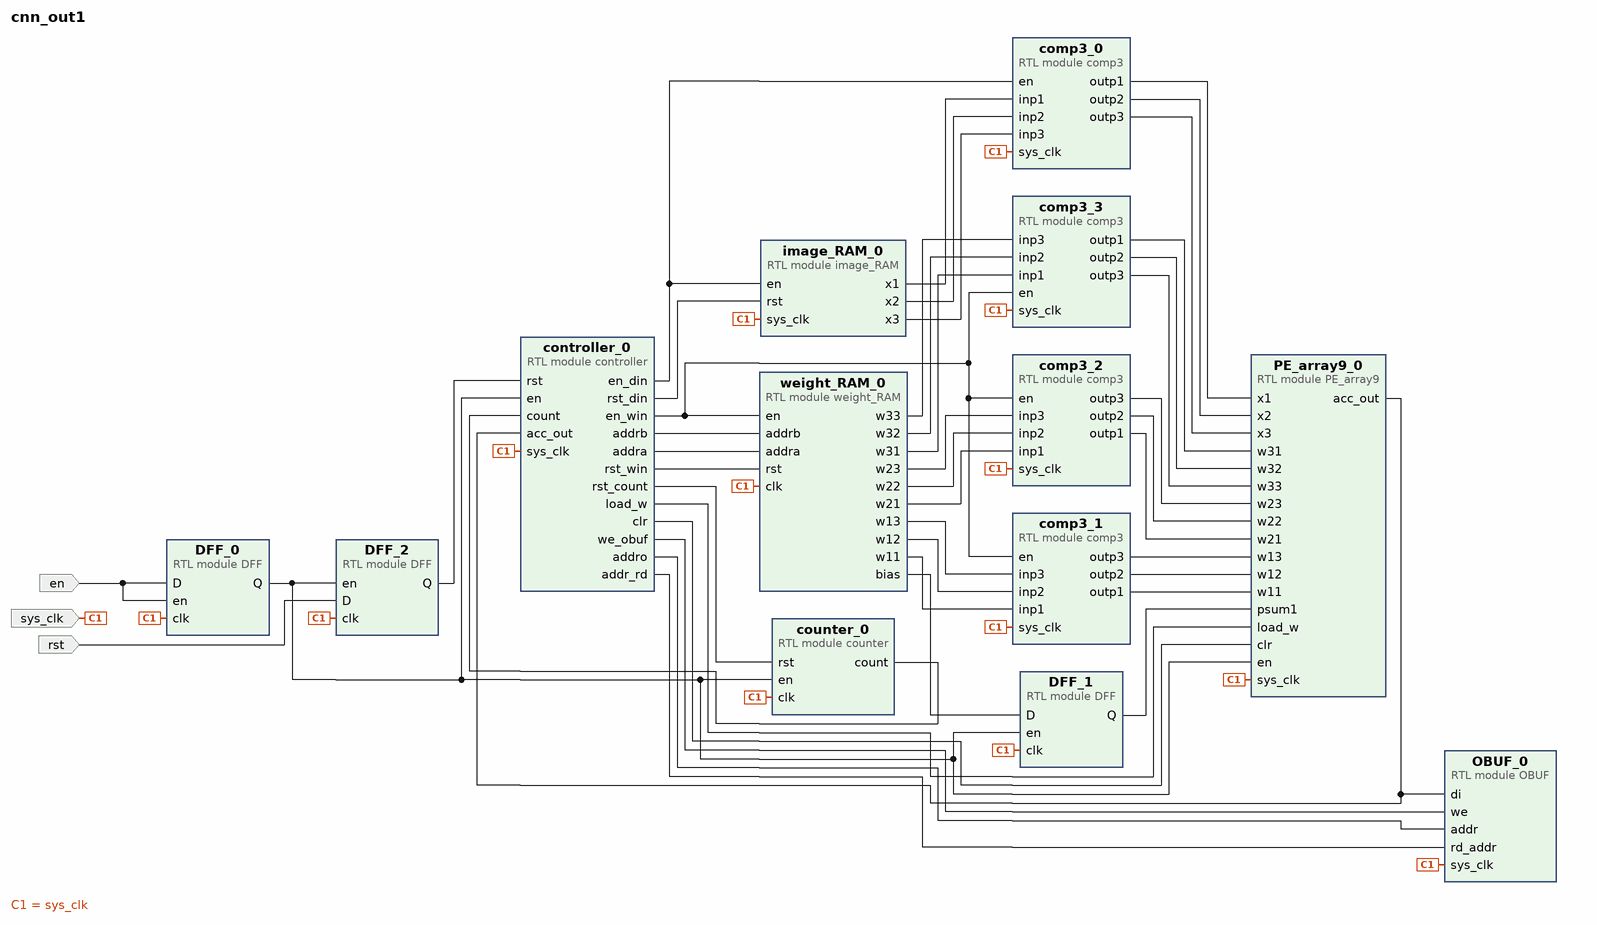
[diagram p0: block diagram of the top level]
# Vivado block design cnn_out1, xc7z020clg400-1, Vivado 2018.2
create_bd_design cnn_out1

create_bd_port -dir I -type clk sys_clk
set_property -dict {CONFIG.FREQ_HZ 125000000} [get_bd_ports sys_clk]
create_bd_port -dir I en
create_bd_port -dir I rst

create_bd_cell -type module -reference counter counter_0
create_bd_cell -type module -reference controller controller_0
create_bd_cell -type module -reference image_RAM image_RAM_0
create_bd_cell -type module -reference weight_RAM weight_RAM_0
create_bd_cell -type module -reference DFF DFF_0
create_bd_cell -type module -reference DFF DFF_2
create_bd_cell -type module -reference DFF DFF_1
create_bd_cell -type module -reference PE_array9 PE_array9_0
create_bd_cell -type module -reference OBUF OBUF_0
create_bd_cell -type module -reference comp3 comp3_0
create_bd_cell -type module -reference comp3 comp3_1
create_bd_cell -type module -reference comp3 comp3_2
create_bd_cell -type module -reference comp3 comp3_3

# ---- connections ----

connect_bd_net -net clk_wiz_0_clk_out1 [get_bd_ports sys_clk] \
  [get_bd_pins counter_0/clk] [get_bd_pins controller_0/sys_clk] [get_bd_pins image_RAM_0/sys_clk] \
  [get_bd_pins weight_RAM_0/clk] [get_bd_pins DFF_0/clk] [get_bd_pins DFF_2/clk] [get_bd_pins DFF_1/clk] \
  [get_bd_pins PE_array9_0/sys_clk] [get_bd_pins OBUF_0/sys_clk] [get_bd_pins comp3_0/sys_clk] [get_bd_pins comp3_1/sys_clk] \
  [get_bd_pins comp3_2/sys_clk] [get_bd_pins comp3_3/sys_clk]
connect_bd_net [get_bd_pins counter_0/count] [get_bd_pins controller_0/count]
connect_bd_net [get_bd_pins controller_0/addrb] [get_bd_pins weight_RAM_0/addrb]
connect_bd_net [get_bd_pins controller_0/addra] [get_bd_pins weight_RAM_0/addra]
connect_bd_net [get_bd_pins controller_0/load_w] [get_bd_pins PE_array9_0/load_w]
connect_bd_net [get_bd_pins PE_array9_0/acc_out] [get_bd_pins controller_0/acc_out] [get_bd_pins OBUF_0/di]
connect_bd_net [get_bd_pins comp3_0/outp1] [get_bd_pins PE_array9_0/x1]
connect_bd_net [get_bd_pins comp3_0/outp2] [get_bd_pins PE_array9_0/x2]
connect_bd_net [get_bd_pins comp3_0/outp3] [get_bd_pins PE_array9_0/x3]
connect_bd_net [get_bd_pins weight_RAM_0/w33] [get_bd_pins comp3_3/inp3]
connect_bd_net [get_bd_pins weight_RAM_0/w32] [get_bd_pins comp3_3/inp2]
connect_bd_net [get_bd_pins weight_RAM_0/w31] [get_bd_pins comp3_3/inp1]
connect_bd_net [get_bd_pins comp3_3/outp1] [get_bd_pins PE_array9_0/w31]
connect_bd_net [get_bd_pins comp3_3/outp2] [get_bd_pins PE_array9_0/w32]
connect_bd_net [get_bd_pins comp3_3/outp3] [get_bd_pins PE_array9_0/w33]
connect_bd_net [get_bd_pins weight_RAM_0/w23] [get_bd_pins comp3_2/inp3]
connect_bd_net [get_bd_pins weight_RAM_0/w22] [get_bd_pins comp3_2/inp2]
connect_bd_net [get_bd_pins weight_RAM_0/w21] [get_bd_pins comp3_2/inp1]
connect_bd_net [get_bd_pins comp3_2/outp3] [get_bd_pins PE_array9_0/w23]
connect_bd_net [get_bd_pins comp3_2/outp2] [get_bd_pins PE_array9_0/w22]
connect_bd_net [get_bd_pins comp3_2/outp1] [get_bd_pins PE_array9_0/w21]
connect_bd_net [get_bd_pins comp3_1/outp3] [get_bd_pins PE_array9_0/w13]
connect_bd_net [get_bd_pins comp3_1/outp2] [get_bd_pins PE_array9_0/w12]
connect_bd_net [get_bd_pins comp3_1/outp1] [get_bd_pins PE_array9_0/w11]
connect_bd_net [get_bd_pins weight_RAM_0/w13] [get_bd_pins comp3_1/inp3]
connect_bd_net [get_bd_pins weight_RAM_0/w12] [get_bd_pins comp3_1/inp2]
connect_bd_net [get_bd_pins weight_RAM_0/w11] [get_bd_pins comp3_1/inp1]
connect_bd_net [get_bd_pins weight_RAM_0/bias] [get_bd_pins DFF_1/D]
connect_bd_net [get_bd_pins DFF_1/Q] [get_bd_pins PE_array9_0/psum1]
connect_bd_net [get_bd_pins controller_0/rst_count] [get_bd_pins counter_0/rst]
connect_bd_net [get_bd_pins controller_0/en_din] [get_bd_pins image_RAM_0/en] [get_bd_pins comp3_0/en]
connect_bd_net [get_bd_pins controller_0/en_win] \
  [get_bd_pins weight_RAM_0/en] [get_bd_pins comp3_1/en] [get_bd_pins comp3_2/en] [get_bd_pins comp3_3/en]
connect_bd_net [get_bd_pins controller_0/rst_win] [get_bd_pins weight_RAM_0/rst]
connect_bd_net [get_bd_pins controller_0/clr] [get_bd_pins PE_array9_0/clr]
connect_bd_net [get_bd_ports en] [get_bd_pins DFF_0/D] [get_bd_pins DFF_0/en]
connect_bd_net [get_bd_pins DFF_2/Q] [get_bd_pins controller_0/rst]
connect_bd_net [get_bd_ports rst] [get_bd_pins DFF_2/D]
connect_bd_net [get_bd_pins controller_0/rst_din] [get_bd_pins image_RAM_0/rst]
connect_bd_net [get_bd_pins image_RAM_0/x1] [get_bd_pins comp3_0/inp1]
connect_bd_net [get_bd_pins image_RAM_0/x2] [get_bd_pins comp3_0/inp2]
connect_bd_net [get_bd_pins image_RAM_0/x3] [get_bd_pins comp3_0/inp3]
connect_bd_net [get_bd_pins DFF_0/Q] \
  [get_bd_pins counter_0/en] [get_bd_pins controller_0/en] [get_bd_pins DFF_2/en] [get_bd_pins DFF_1/en] \
  [get_bd_pins PE_array9_0/en]
connect_bd_net [get_bd_pins controller_0/we_obuf] [get_bd_pins OBUF_0/we]
connect_bd_net [get_bd_pins controller_0/addro] [get_bd_pins OBUF_0/addr]
connect_bd_net [get_bd_pins controller_0/addr_rd] [get_bd_pins OBUF_0/rd_addr]

validate_bd_design
save_bd_design
